# Altium schematic sheet DCDC_ST1S14_3.3V.SchDoc
size A4
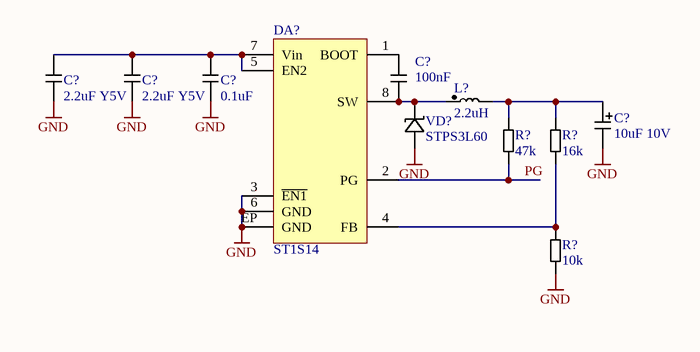
[diagram p0: DCDC_ST1S14_3.3V.SchDoc]

## Parts
(Parts that share a designator on the sheet are numbered #1, #2 ... from top to bottom, then left to right.)
C?#1  2.2uF Y5V  [C0805]
C?#2  2.2uF Y5V  [C0805]
C?#3  0.1uF  [C0603]
C?#4  100nF  [C0603]
C?#5  10uF 10V  [SMD A]
DA?  ST1S14  [SO-8EP]
L?  2.2uH  [NR60]
R?#1  47k  [R0603]
R?#2  16k  [R0603]
R?#3  10k  [R0603]
VD?  STPS3L60  [SMB]

## Nets
GND: C?#1.2 C?#2.2 C?#3.2 C?#5.2 DA?.3(~{EN1}) DA?.6(GND) DA?.EP(GND) R?#3.1 VD?.1(K)
PG: DA?.2(PG) R?#1.1
NetC?#1_1: C?#1.1 C?#2.1 C?#3.1 DA?.5(EN2) DA?.7(Vin)
NetC?#4_1: C?#4.1 DA?.1(BOOT)
NetC?#4_2: C?#4.2 DA?.8(SW) L?.1 VD?.2(A)
NetC?#5_1: C?#5.1 L?.2 R?#1.2 R?#2.2
NetDA?_4: DA?.4(FB) R?#2.1 R?#3.2

## Library data of the parts
C?#1-C?#4 = C: Capacitor
C?#5 = CP: Capacitor polarized
DA? = ST1S14: ST DC-DC converter
L? = L: Inductor
R?#1-R?#3 = R: Resistor
VD? = STPS3L60: ST diode